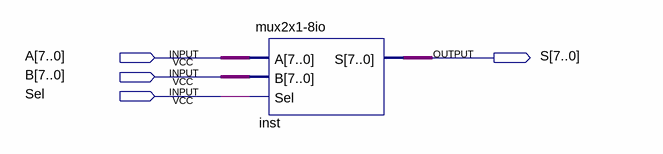
[diagram p0: schematic sheet]
// Quartus schematic mux.bdf as structural Verilog: 1 symbols, 4 pins
module mux (
  input  [7:0] A,
  input  [7:0] B,
  input  Sel,
  output [7:0] S
);

  \mux2x1-8io  inst (.A(A), .B(B), .Sel(Sel), .S(S));
endmodule
